# Altium schematic sheet MUX.SchDoc
size A; SheetNumber: 4; SheetTotal: 5
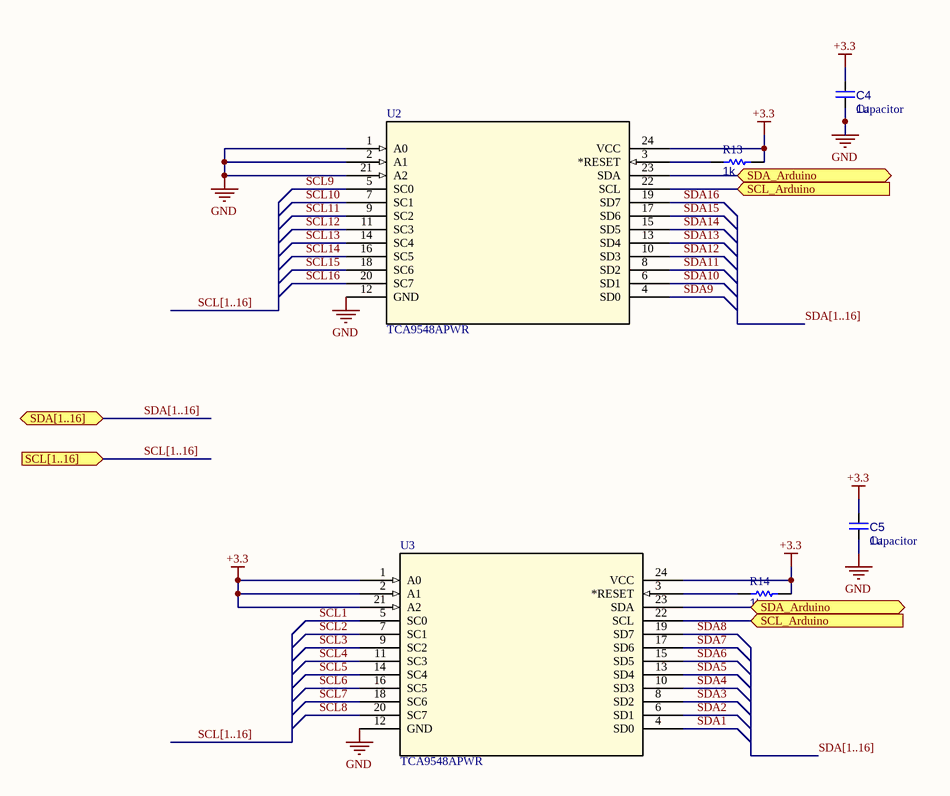
[diagram p0: MUX.SchDoc]

## Parts
C4  Capacitor  value 1u  [C0603B]
C5  Capacitor  value 1u  [C0603B]
R13  value 1k  [R0603B]  (hidden comment: Resistor)
R14  value 1k  [R0603B]  (hidden comment: Resistor)
U2  TCA9548APWR  [PW24_TEX]
U3  TCA9548APWR  [PW24_TEX]

## Ports
SCL[1..16] (in), SCL_Arduino (in), SDA[1..16] (bidir), SDA_Arduino (bidir)

## Nets
+3.3: C4.2 C5.2 R13.2 R14.2 U2.24(VCC) U3.1(A0) U3.2(A1) U3.21(A2) U3.24(VCC)
GND: C4.1 C5.1 U2.1(A0) U2.2(A1) U2.12(GND) U2.21(A2) U3.12(GND)
SCL1: U3.5(SC0)
SCL2: U3.7(SC1)
SCL3: U3.9(SC2)
SCL4: U3.11(SC3)
SCL5: U3.14(SC4)
SCL6: U3.16(SC5)
SCL7: U3.18(SC6)
SCL8: U3.20(SC7)
SCL9: U2.5(SC0)
SCL10: U2.7(SC1)
SCL11: U2.9(SC2)
SCL12: U2.11(SC3)
SCL13: U2.14(SC4)
SCL14: U2.16(SC5)
SCL15: U2.18(SC6)
SCL16: U2.20(SC7)
SCL_Arduino: U2.22(SCL) U3.22(SCL) ; port SCL_Arduino
SDA1: U3.4(SD0)
SDA2: U3.6(SD1)
SDA3: U3.8(SD2)
SDA4: U3.10(SD3)
SDA5: U3.13(SD4)
SDA6: U3.15(SD5)
SDA7: U3.17(SD6)
SDA8: U3.19(SD7)
SDA9: U2.4(SD0)
SDA10: U2.6(SD1)
SDA11: U2.8(SD2)
SDA12: U2.10(SD3)
SDA13: U2.13(SD4)
SDA14: U2.15(SD5)
SDA15: U2.17(SD6)
SDA16: U2.19(SD7)
SDA_Arduino: U2.23(SDA) U3.23(SDA) ; port SDA_Arduino
NetR13_1: R13.1 U2.3(*RESET)
NetR14_1: R14.1 U3.3(*RESET)

## Buses and harness runs
bus SCL[1..16]
bus SCL[1..16] = port SCL[1..16]
bus SDA[1..16]
bus SDA[1..16] = port SDA[1..16]

## Library data of the parts
C4 C5 = CMP-001-00000-10: Non-polarized capacitor
R13 R14 = CMP-009-00002-14
U2 U3 = CMP-208-000003-3: No Description Available; Mfr_Name: Texas Instruments; Output Polarity: True; Max Supply Voltage: 5.5V; Nominal Supply Voltage: 1.8V; Logic Type: MULTIPLEXER; Number of Outputs: 8; Channels: 1; Package Body Material: Plastic; Propagation Delay (tpd): 1ns; Min Supply Voltage: 1.65V; Source: TCA9548APWR.SchLib; Design Item ID: TCA9548APWR; RefDes: RefDes; Type: Type; Peak Reflow Temperature (Cel): 260°C; Moisture Sensitivity Level: 1; Min Operating Temperature: -40°C; Terminal Finish: Nickel; Case/Package: TSSOP; Package Style: SMALL OUTLINE, THIN PROFILE, SHRINK PITCHMeter; JESD-609 Code: e4; Height - Seated (Max): 1.2mm; JESD-30 Code: R-PDSO-G24; Pins: 24; Temperature Grade: INDUSTRIAL; Number of Inputs: 1; Terminal Pitch: 0.65mm; Width: 4.4mm; Length: 7.8mm; Terminal Form: Gull Wing; Terminal Position: DUAL; Package Shape: Rectangular; Surface Mount: Yes; Max Operating Temperature: 85°C; RoHS Compliant: Yes; Reach SVHC Compliant: Yes